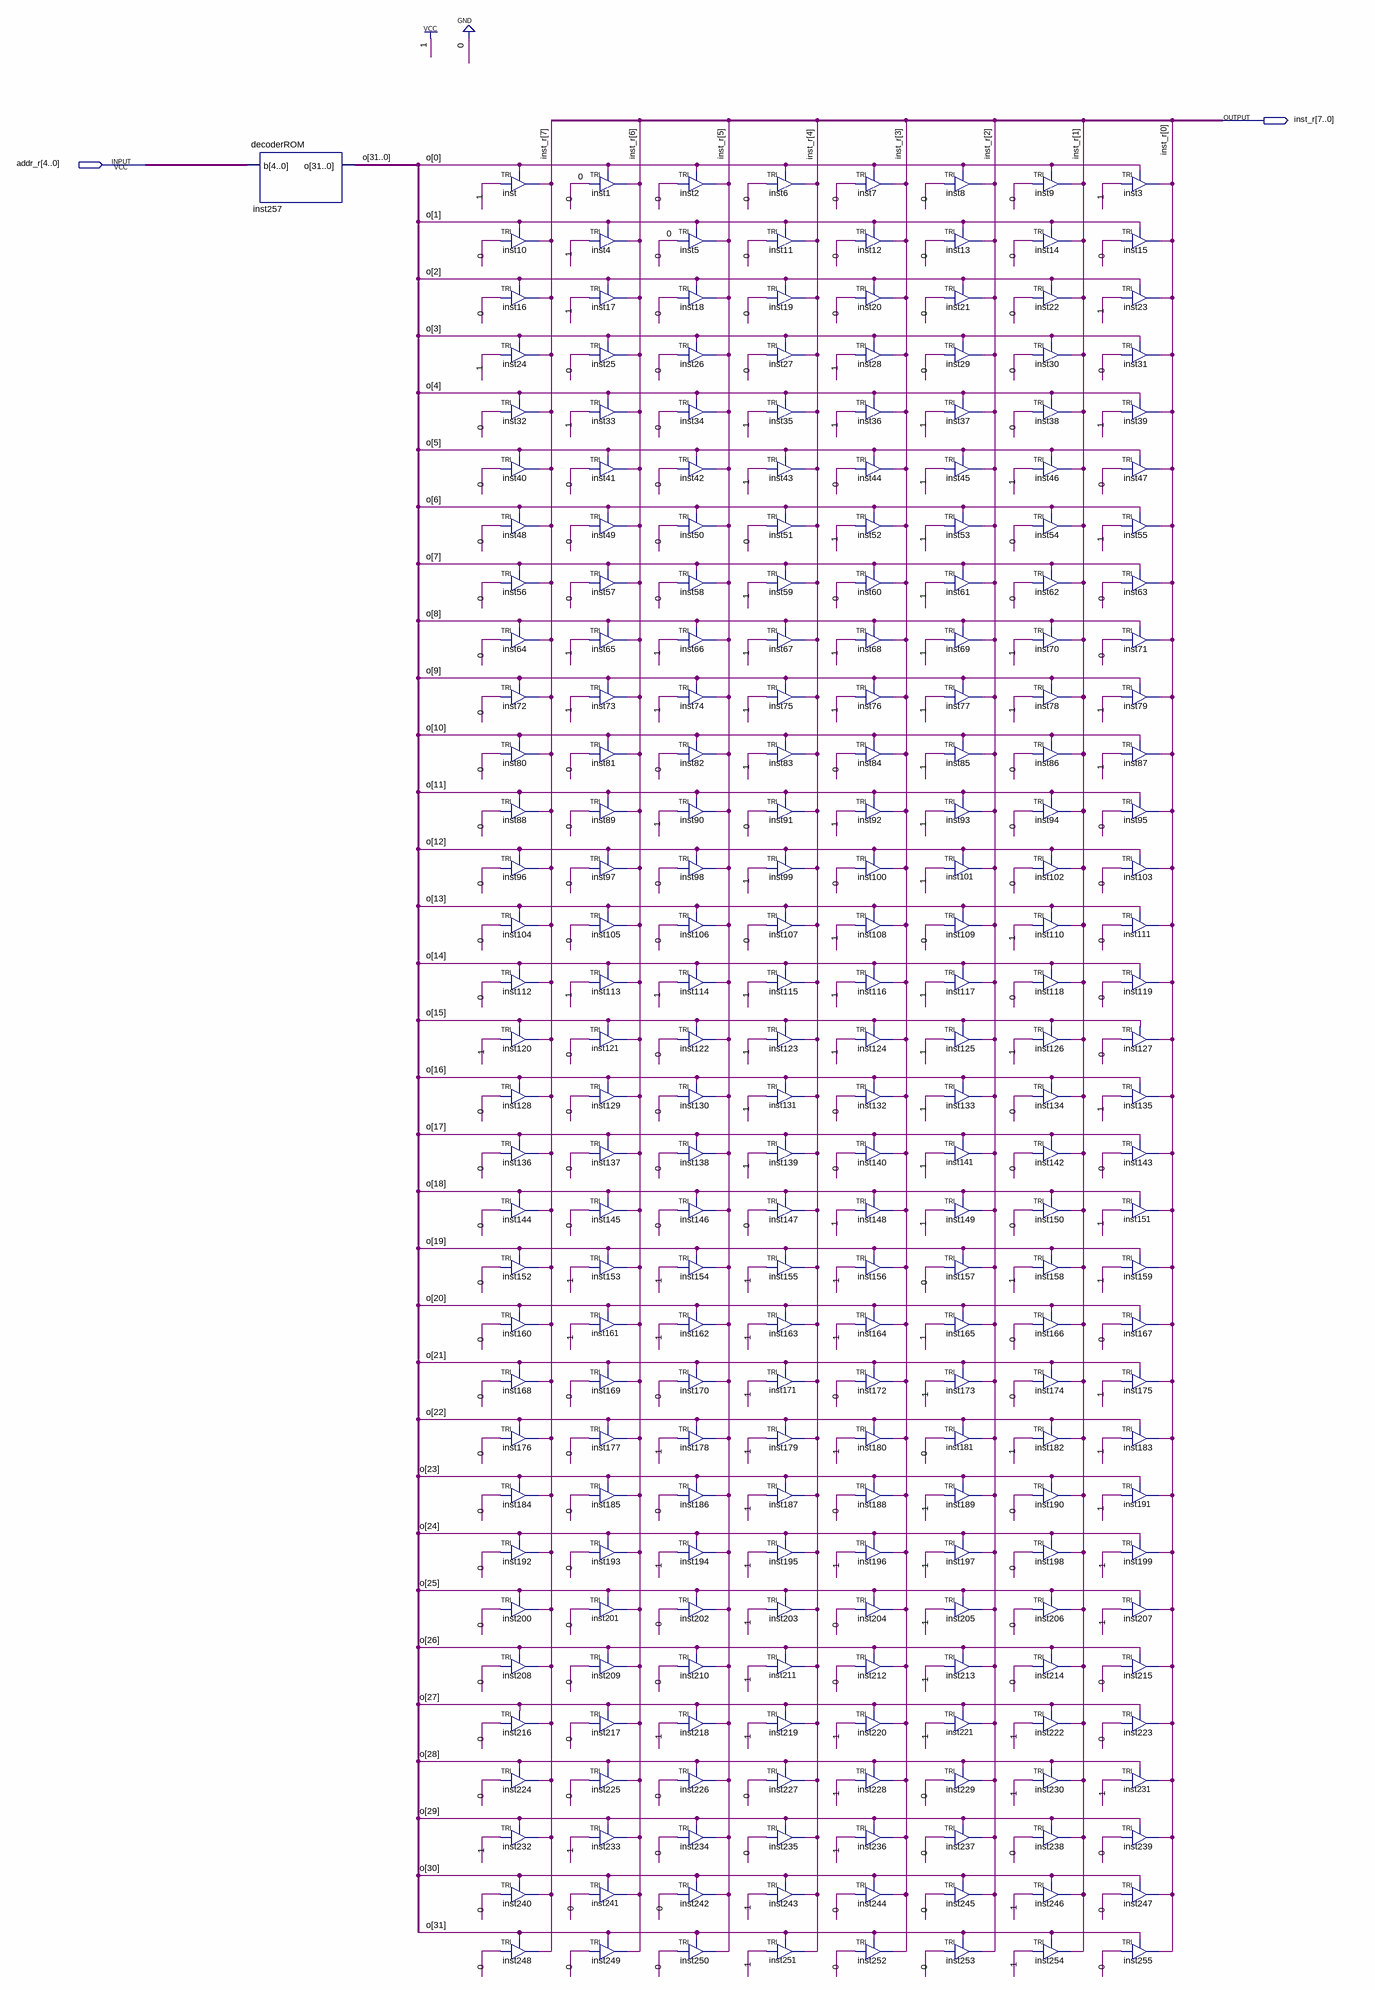
[diagram p0: schematic sheet]
// Quartus schematic programaFibonacci.bdf as structural Verilog: 257 symbols, 2 pins
module programaFibonacci (
  input  [4:0] addr_r,
  output [7:0] inst_r
);

  wire [31:0] o;

  decoderROM inst257 (.b(addr_r), .o(o));
  TRI inst (.IN(1'b1), .OE(o[0]), .OUT(inst_r[7]));
  TRI inst10 (.IN(1'b0), .OE(o[1]), .OUT(inst_r[7]));
  TRI inst16 (.IN(1'b0), .OE(o[2]), .OUT(inst_r[7]));
  TRI inst24 (.IN(1'b1), .OE(o[3]), .OUT(inst_r[7]));
  TRI inst32 (.IN(1'b0), .OE(o[4]), .OUT(inst_r[7]));
  TRI inst40 (.IN(1'b0), .OE(o[5]), .OUT(inst_r[7]));
  TRI inst48 (.IN(1'b0), .OE(o[6]), .OUT(inst_r[7]));
  TRI inst56 (.IN(1'b0), .OE(o[7]), .OUT(inst_r[7]));
  TRI inst64 (.IN(1'b0), .OE(o[8]), .OUT(inst_r[7]));
  TRI inst72 (.IN(1'b0), .OE(o[9]), .OUT(inst_r[7]));
  TRI inst80 (.IN(1'b0), .OE(o[10]), .OUT(inst_r[7]));
  TRI inst88 (.IN(1'b0), .OE(o[11]), .OUT(inst_r[7]));
  TRI inst96 (.IN(1'b0), .OE(o[12]), .OUT(inst_r[7]));
  TRI inst104 (.IN(1'b0), .OE(o[13]), .OUT(inst_r[7]));
  TRI inst112 (.IN(1'b0), .OE(o[14]), .OUT(inst_r[7]));
  TRI inst120 (.IN(1'b1), .OE(o[15]), .OUT(inst_r[7]));
  TRI inst128 (.IN(1'b0), .OE(o[16]), .OUT(inst_r[7]));
  TRI inst136 (.IN(1'b0), .OE(o[17]), .OUT(inst_r[7]));
  TRI inst144 (.IN(1'b0), .OE(o[18]), .OUT(inst_r[7]));
  TRI inst152 (.IN(1'b0), .OE(o[19]), .OUT(inst_r[7]));
  TRI inst160 (.IN(1'b0), .OE(o[20]), .OUT(inst_r[7]));
  TRI inst168 (.IN(1'b0), .OE(o[21]), .OUT(inst_r[7]));
  TRI inst176 (.IN(1'b0), .OE(o[22]), .OUT(inst_r[7]));
  TRI inst184 (.IN(1'b0), .OE(o[23]), .OUT(inst_r[7]));
  TRI inst192 (.IN(1'b0), .OE(o[24]), .OUT(inst_r[7]));
  TRI inst200 (.IN(1'b0), .OE(o[25]), .OUT(inst_r[7]));
  TRI inst208 (.IN(1'b0), .OE(o[26]), .OUT(inst_r[7]));
  TRI inst216 (.IN(1'b0), .OE(o[27]), .OUT(inst_r[7]));
  TRI inst224 (.IN(1'b0), .OE(o[28]), .OUT(inst_r[7]));
  TRI inst232 (.IN(1'b1), .OE(o[29]), .OUT(inst_r[7]));
  TRI inst240 (.IN(1'b0), .OE(o[30]), .OUT(inst_r[7]));
  TRI inst248 (.IN(1'b0), .OE(o[31]), .OUT(inst_r[7]));
  TRI inst1 (.IN(1'b0), .OE(o[0]), .OUT(inst_r[6]));
  TRI inst4 (.IN(1'b1), .OE(o[1]), .OUT(inst_r[6]));
  TRI inst17 (.IN(1'b1), .OE(o[2]), .OUT(inst_r[6]));
  TRI inst25 (.IN(1'b0), .OE(o[3]), .OUT(inst_r[6]));
  TRI inst33 (.IN(1'b1), .OE(o[4]), .OUT(inst_r[6]));
  TRI inst41 (.IN(1'b0), .OE(o[5]), .OUT(inst_r[6]));
  TRI inst49 (.IN(1'b0), .OE(o[6]), .OUT(inst_r[6]));
  TRI inst57 (.IN(1'b0), .OE(o[7]), .OUT(inst_r[6]));
  TRI inst65 (.IN(1'b1), .OE(o[8]), .OUT(inst_r[6]));
  TRI inst73 (.IN(1'b1), .OE(o[9]), .OUT(inst_r[6]));
  TRI inst81 (.IN(1'b0), .OE(o[10]), .OUT(inst_r[6]));
  TRI inst89 (.IN(1'b0), .OE(o[11]), .OUT(inst_r[6]));
  TRI inst97 (.IN(1'b0), .OE(o[12]), .OUT(inst_r[6]));
  TRI inst105 (.IN(1'b0), .OE(o[13]), .OUT(inst_r[6]));
  TRI inst113 (.IN(1'b1), .OE(o[14]), .OUT(inst_r[6]));
  TRI inst121 (.IN(1'b0), .OE(o[15]), .OUT(inst_r[6]));
  TRI inst129 (.IN(1'b0), .OE(o[16]), .OUT(inst_r[6]));
  TRI inst137 (.IN(1'b0), .OE(o[17]), .OUT(inst_r[6]));
  TRI inst145 (.IN(1'b0), .OE(o[18]), .OUT(inst_r[6]));
  TRI inst153 (.IN(1'b1), .OE(o[19]), .OUT(inst_r[6]));
  TRI inst161 (.IN(1'b1), .OE(o[20]), .OUT(inst_r[6]));
  TRI inst169 (.IN(1'b0), .OE(o[21]), .OUT(inst_r[6]));
  TRI inst177 (.IN(1'b0), .OE(o[22]), .OUT(inst_r[6]));
  TRI inst185 (.IN(1'b0), .OE(o[23]), .OUT(inst_r[6]));
  TRI inst193 (.IN(1'b0), .OE(o[24]), .OUT(inst_r[6]));
  TRI inst201 (.IN(1'b0), .OE(o[25]), .OUT(inst_r[6]));
  TRI inst209 (.IN(1'b0), .OE(o[26]), .OUT(inst_r[6]));
  TRI inst217 (.IN(1'b0), .OE(o[27]), .OUT(inst_r[6]));
  TRI inst225 (.IN(1'b0), .OE(o[28]), .OUT(inst_r[6]));
  TRI inst233 (.IN(1'b1), .OE(o[29]), .OUT(inst_r[6]));
  TRI inst241 (.IN(1'b0), .OE(o[30]), .OUT(inst_r[6]));
  TRI inst249 (.IN(1'b0), .OE(o[31]), .OUT(inst_r[6]));
  TRI inst2 (.IN(1'b0), .OE(o[0]), .OUT(inst_r[5]));
  TRI inst5 (.IN(1'b0), .OE(o[1]), .OUT(inst_r[5]));
  TRI inst18 (.IN(1'b0), .OE(o[2]), .OUT(inst_r[5]));
  TRI inst26 (.IN(1'b0), .OE(o[3]), .OUT(inst_r[5]));
  TRI inst34 (.IN(1'b0), .OE(o[4]), .OUT(inst_r[5]));
  TRI inst42 (.IN(1'b0), .OE(o[5]), .OUT(inst_r[5]));
  TRI inst50 (.IN(1'b0), .OE(o[6]), .OUT(inst_r[5]));
  TRI inst58 (.IN(1'b0), .OE(o[7]), .OUT(inst_r[5]));
  TRI inst66 (.IN(1'b1), .OE(o[8]), .OUT(inst_r[5]));
  TRI inst74 (.IN(1'b1), .OE(o[9]), .OUT(inst_r[5]));
  TRI inst82 (.IN(1'b0), .OE(o[10]), .OUT(inst_r[5]));
  TRI inst90 (.IN(1'b1), .OE(o[11]), .OUT(inst_r[5]));
  TRI inst98 (.IN(1'b0), .OE(o[12]), .OUT(inst_r[5]));
  TRI inst106 (.IN(1'b0), .OE(o[13]), .OUT(inst_r[5]));
  TRI inst114 (.IN(1'b1), .OE(o[14]), .OUT(inst_r[5]));
  TRI inst122 (.IN(1'b0), .OE(o[15]), .OUT(inst_r[5]));
  TRI inst130 (.IN(1'b0), .OE(o[16]), .OUT(inst_r[5]));
  TRI inst138 (.IN(1'b0), .OE(o[17]), .OUT(inst_r[5]));
  TRI inst146 (.IN(1'b0), .OE(o[18]), .OUT(inst_r[5]));
  TRI inst154 (.IN(1'b1), .OE(o[19]), .OUT(inst_r[5]));
  TRI inst162 (.IN(1'b1), .OE(o[20]), .OUT(inst_r[5]));
  TRI inst170 (.IN(1'b0), .OE(o[21]), .OUT(inst_r[5]));
  TRI inst178 (.IN(1'b1), .OE(o[22]), .OUT(inst_r[5]));
  TRI inst186 (.IN(1'b0), .OE(o[23]), .OUT(inst_r[5]));
  TRI inst194 (.IN(1'b1), .OE(o[24]), .OUT(inst_r[5]));
  TRI inst202 (.IN(1'b0), .OE(o[25]), .OUT(inst_r[5]));
  TRI inst210 (.IN(1'b0), .OE(o[26]), .OUT(inst_r[5]));
  TRI inst218 (.IN(1'b1), .OE(o[27]), .OUT(inst_r[5]));
  TRI inst226 (.IN(1'b0), .OE(o[28]), .OUT(inst_r[5]));
  TRI inst234 (.IN(1'b0), .OE(o[29]), .OUT(inst_r[5]));
  TRI inst242 (.IN(1'b0), .OE(o[30]), .OUT(inst_r[5]));
  TRI inst250 (.IN(1'b0), .OE(o[31]), .OUT(inst_r[5]));
  TRI inst6 (.IN(1'b0), .OE(o[0]), .OUT(inst_r[4]));
  TRI inst11 (.IN(1'b0), .OE(o[1]), .OUT(inst_r[4]));
  TRI inst19 (.IN(1'b0), .OE(o[2]), .OUT(inst_r[4]));
  TRI inst27 (.IN(1'b0), .OE(o[3]), .OUT(inst_r[4]));
  TRI inst35 (.IN(1'b1), .OE(o[4]), .OUT(inst_r[4]));
  TRI inst43 (.IN(1'b1), .OE(o[5]), .OUT(inst_r[4]));
  TRI inst51 (.IN(1'b0), .OE(o[6]), .OUT(inst_r[4]));
  TRI inst59 (.IN(1'b1), .OE(o[7]), .OUT(inst_r[4]));
  TRI inst67 (.IN(1'b1), .OE(o[8]), .OUT(inst_r[4]));
  TRI inst75 (.IN(1'b1), .OE(o[9]), .OUT(inst_r[4]));
  TRI inst83 (.IN(1'b1), .OE(o[10]), .OUT(inst_r[4]));
  TRI inst91 (.IN(1'b0), .OE(o[11]), .OUT(inst_r[4]));
  TRI inst99 (.IN(1'b1), .OE(o[12]), .OUT(inst_r[4]));
  TRI inst107 (.IN(1'b0), .OE(o[13]), .OUT(inst_r[4]));
  TRI inst115 (.IN(1'b1), .OE(o[14]), .OUT(inst_r[4]));
  TRI inst123 (.IN(1'b1), .OE(o[15]), .OUT(inst_r[4]));
  TRI inst131 (.IN(1'b1), .OE(o[16]), .OUT(inst_r[4]));
  TRI inst139 (.IN(1'b1), .OE(o[17]), .OUT(inst_r[4]));
  TRI inst147 (.IN(1'b0), .OE(o[18]), .OUT(inst_r[4]));
  TRI inst155 (.IN(1'b1), .OE(o[19]), .OUT(inst_r[4]));
  TRI inst163 (.IN(1'b1), .OE(o[20]), .OUT(inst_r[4]));
  TRI inst171 (.IN(1'b1), .OE(o[21]), .OUT(inst_r[4]));
  TRI inst179 (.IN(1'b1), .OE(o[22]), .OUT(inst_r[4]));
  TRI inst187 (.IN(1'b1), .OE(o[23]), .OUT(inst_r[4]));
  TRI inst195 (.IN(1'b1), .OE(o[24]), .OUT(inst_r[4]));
  TRI inst203 (.IN(1'b1), .OE(o[25]), .OUT(inst_r[4]));
  TRI inst211 (.IN(1'b1), .OE(o[26]), .OUT(inst_r[4]));
  TRI inst219 (.IN(1'b1), .OE(o[27]), .OUT(inst_r[4]));
  TRI inst227 (.IN(1'b0), .OE(o[28]), .OUT(inst_r[4]));
  TRI inst235 (.IN(1'b0), .OE(o[29]), .OUT(inst_r[4]));
  TRI inst243 (.IN(1'b1), .OE(o[30]), .OUT(inst_r[4]));
  TRI inst251 (.IN(1'b1), .OE(o[31]), .OUT(inst_r[4]));
  TRI inst7 (.IN(1'b0), .OE(o[0]), .OUT(inst_r[3]));
  TRI inst12 (.IN(1'b0), .OE(o[1]), .OUT(inst_r[3]));
  TRI inst20 (.IN(1'b0), .OE(o[2]), .OUT(inst_r[3]));
  TRI inst28 (.IN(1'b1), .OE(o[3]), .OUT(inst_r[3]));
  TRI inst36 (.IN(1'b1), .OE(o[4]), .OUT(inst_r[3]));
  TRI inst44 (.IN(1'b0), .OE(o[5]), .OUT(inst_r[3]));
  TRI inst52 (.IN(1'b1), .OE(o[6]), .OUT(inst_r[3]));
  TRI inst60 (.IN(1'b0), .OE(o[7]), .OUT(inst_r[3]));
  TRI inst68 (.IN(1'b1), .OE(o[8]), .OUT(inst_r[3]));
  TRI inst76 (.IN(1'b1), .OE(o[9]), .OUT(inst_r[3]));
  TRI inst84 (.IN(1'b0), .OE(o[10]), .OUT(inst_r[3]));
  TRI inst92 (.IN(1'b1), .OE(o[11]), .OUT(inst_r[3]));
  TRI inst100 (.IN(1'b0), .OE(o[12]), .OUT(inst_r[3]));
  TRI inst108 (.IN(1'b1), .OE(o[13]), .OUT(inst_r[3]));
  TRI inst116 (.IN(1'b1), .OE(o[14]), .OUT(inst_r[3]));
  TRI inst124 (.IN(1'b1), .OE(o[15]), .OUT(inst_r[3]));
  TRI inst132 (.IN(1'b0), .OE(o[16]), .OUT(inst_r[3]));
  TRI inst140 (.IN(1'b0), .OE(o[17]), .OUT(inst_r[3]));
  TRI inst148 (.IN(1'b1), .OE(o[18]), .OUT(inst_r[3]));
  TRI inst156 (.IN(1'b1), .OE(o[19]), .OUT(inst_r[3]));
  TRI inst164 (.IN(1'b1), .OE(o[20]), .OUT(inst_r[3]));
  TRI inst172 (.IN(1'b0), .OE(o[21]), .OUT(inst_r[3]));
  TRI inst180 (.IN(1'b1), .OE(o[22]), .OUT(inst_r[3]));
  TRI inst188 (.IN(1'b0), .OE(o[23]), .OUT(inst_r[3]));
  TRI inst196 (.IN(1'b1), .OE(o[24]), .OUT(inst_r[3]));
  TRI inst204 (.IN(1'b0), .OE(o[25]), .OUT(inst_r[3]));
  TRI inst212 (.IN(1'b0), .OE(o[26]), .OUT(inst_r[3]));
  TRI inst220 (.IN(1'b1), .OE(o[27]), .OUT(inst_r[3]));
  TRI inst228 (.IN(1'b1), .OE(o[28]), .OUT(inst_r[3]));
  TRI inst236 (.IN(1'b1), .OE(o[29]), .OUT(inst_r[3]));
  TRI inst244 (.IN(1'b0), .OE(o[30]), .OUT(inst_r[3]));
  TRI inst252 (.IN(1'b0), .OE(o[31]), .OUT(inst_r[3]));
  TRI inst8 (.IN(1'b0), .OE(o[0]), .OUT(inst_r[2]));
  TRI inst13 (.IN(1'b0), .OE(o[1]), .OUT(inst_r[2]));
  TRI inst21 (.IN(1'b0), .OE(o[2]), .OUT(inst_r[2]));
  TRI inst29 (.IN(1'b0), .OE(o[3]), .OUT(inst_r[2]));
  TRI inst37 (.IN(1'b1), .OE(o[4]), .OUT(inst_r[2]));
  TRI inst45 (.IN(1'b1), .OE(o[5]), .OUT(inst_r[2]));
  TRI inst53 (.IN(1'b1), .OE(o[6]), .OUT(inst_r[2]));
  TRI inst61 (.IN(1'b1), .OE(o[7]), .OUT(inst_r[2]));
  TRI inst69 (.IN(1'b1), .OE(o[8]), .OUT(inst_r[2]));
  TRI inst77 (.IN(1'b1), .OE(o[9]), .OUT(inst_r[2]));
  TRI inst85 (.IN(1'b1), .OE(o[10]), .OUT(inst_r[2]));
  TRI inst93 (.IN(1'b1), .OE(o[11]), .OUT(inst_r[2]));
  TRI inst101 (.IN(1'b1), .OE(o[12]), .OUT(inst_r[2]));
  TRI inst109 (.IN(1'b0), .OE(o[13]), .OUT(inst_r[2]));
  TRI inst117 (.IN(1'b1), .OE(o[14]), .OUT(inst_r[2]));
  TRI inst125 (.IN(1'b1), .OE(o[15]), .OUT(inst_r[2]));
  TRI inst133 (.IN(1'b1), .OE(o[16]), .OUT(inst_r[2]));
  TRI inst141 (.IN(1'b1), .OE(o[17]), .OUT(inst_r[2]));
  TRI inst149 (.IN(1'b1), .OE(o[18]), .OUT(inst_r[2]));
  TRI inst157 (.IN(1'b0), .OE(o[19]), .OUT(inst_r[2]));
  TRI inst165 (.IN(1'b1), .OE(o[20]), .OUT(inst_r[2]));
  TRI inst173 (.IN(1'b1), .OE(o[21]), .OUT(inst_r[2]));
  TRI inst181 (.IN(1'b0), .OE(o[22]), .OUT(inst_r[2]));
  TRI inst189 (.IN(1'b1), .OE(o[23]), .OUT(inst_r[2]));
  TRI inst197 (.IN(1'b1), .OE(o[24]), .OUT(inst_r[2]));
  TRI inst205 (.IN(1'b1), .OE(o[25]), .OUT(inst_r[2]));
  TRI inst213 (.IN(1'b1), .OE(o[26]), .OUT(inst_r[2]));
  TRI inst221 (.IN(1'b1), .OE(o[27]), .OUT(inst_r[2]));
  TRI inst229 (.IN(1'b0), .OE(o[28]), .OUT(inst_r[2]));
  TRI inst237 (.IN(1'b0), .OE(o[29]), .OUT(inst_r[2]));
  TRI inst245 (.IN(1'b0), .OE(o[30]), .OUT(inst_r[2]));
  TRI inst253 (.IN(1'b0), .OE(o[31]), .OUT(inst_r[2]));
  TRI inst9 (.IN(1'b0), .OE(o[0]), .OUT(inst_r[1]));
  TRI inst14 (.IN(1'b0), .OE(o[1]), .OUT(inst_r[1]));
  TRI inst22 (.IN(1'b0), .OE(o[2]), .OUT(inst_r[1]));
  TRI inst30 (.IN(1'b0), .OE(o[3]), .OUT(inst_r[1]));
  TRI inst38 (.IN(1'b0), .OE(o[4]), .OUT(inst_r[1]));
  TRI inst46 (.IN(1'b1), .OE(o[5]), .OUT(inst_r[1]));
  TRI inst54 (.IN(1'b0), .OE(o[6]), .OUT(inst_r[1]));
  TRI inst62 (.IN(1'b0), .OE(o[7]), .OUT(inst_r[1]));
  TRI inst70 (.IN(1'b1), .OE(o[8]), .OUT(inst_r[1]));
  TRI inst78 (.IN(1'b1), .OE(o[9]), .OUT(inst_r[1]));
  TRI inst86 (.IN(1'b0), .OE(o[10]), .OUT(inst_r[1]));
  TRI inst94 (.IN(1'b0), .OE(o[11]), .OUT(inst_r[1]));
  TRI inst102 (.IN(1'b0), .OE(o[12]), .OUT(inst_r[1]));
  TRI inst110 (.IN(1'b1), .OE(o[13]), .OUT(inst_r[1]));
  TRI inst118 (.IN(1'b0), .OE(o[14]), .OUT(inst_r[1]));
  TRI inst126 (.IN(1'b1), .OE(o[15]), .OUT(inst_r[1]));
  TRI inst134 (.IN(1'b0), .OE(o[16]), .OUT(inst_r[1]));
  TRI inst142 (.IN(1'b0), .OE(o[17]), .OUT(inst_r[1]));
  TRI inst150 (.IN(1'b0), .OE(o[18]), .OUT(inst_r[1]));
  TRI inst158 (.IN(1'b1), .OE(o[19]), .OUT(inst_r[1]));
  TRI inst166 (.IN(1'b0), .OE(o[20]), .OUT(inst_r[1]));
  TRI inst174 (.IN(1'b0), .OE(o[21]), .OUT(inst_r[1]));
  TRI inst182 (.IN(1'b1), .OE(o[22]), .OUT(inst_r[1]));
  TRI inst190 (.IN(1'b0), .OE(o[23]), .OUT(inst_r[1]));
  TRI inst198 (.IN(1'b0), .OE(o[24]), .OUT(inst_r[1]));
  TRI inst206 (.IN(1'b0), .OE(o[25]), .OUT(inst_r[1]));
  TRI inst214 (.IN(1'b0), .OE(o[26]), .OUT(inst_r[1]));
  TRI inst222 (.IN(1'b1), .OE(o[27]), .OUT(inst_r[1]));
  TRI inst230 (.IN(1'b1), .OE(o[28]), .OUT(inst_r[1]));
  TRI inst238 (.IN(1'b0), .OE(o[29]), .OUT(inst_r[1]));
  TRI inst246 (.IN(1'b1), .OE(o[30]), .OUT(inst_r[1]));
  TRI inst254 (.IN(1'b1), .OE(o[31]), .OUT(inst_r[1]));
  TRI inst3 (.IN(1'b1), .OE(o[0]), .OUT(inst_r[0]));
  TRI inst15 (.IN(1'b0), .OE(o[1]), .OUT(inst_r[0]));
  TRI inst23 (.IN(1'b1), .OE(o[2]), .OUT(inst_r[0]));
  TRI inst31 (.IN(1'b0), .OE(o[3]), .OUT(inst_r[0]));
  TRI inst39 (.IN(1'b1), .OE(o[4]), .OUT(inst_r[0]));
  TRI inst47 (.IN(1'b0), .OE(o[5]), .OUT(inst_r[0]));
  TRI inst55 (.IN(1'b1), .OE(o[6]), .OUT(inst_r[0]));
  TRI inst63 (.IN(1'b0), .OE(o[7]), .OUT(inst_r[0]));
  TRI inst71 (.IN(1'b0), .OE(o[8]), .OUT(inst_r[0]));
  TRI inst79 (.IN(1'b1), .OE(o[9]), .OUT(inst_r[0]));
  TRI inst87 (.IN(1'b1), .OE(o[10]), .OUT(inst_r[0]));
  TRI inst95 (.IN(1'b0), .OE(o[11]), .OUT(inst_r[0]));
  TRI inst103 (.IN(1'b0), .OE(o[12]), .OUT(inst_r[0]));
  TRI inst111 (.IN(1'b0), .OE(o[13]), .OUT(inst_r[0]));
  TRI inst119 (.IN(1'b0), .OE(o[14]), .OUT(inst_r[0]));
  TRI inst127 (.IN(1'b0), .OE(o[15]), .OUT(inst_r[0]));
  TRI inst135 (.IN(1'b1), .OE(o[16]), .OUT(inst_r[0]));
  TRI inst143 (.IN(1'b0), .OE(o[17]), .OUT(inst_r[0]));
  TRI inst151 (.IN(1'b1), .OE(o[18]), .OUT(inst_r[0]));
  TRI inst159 (.IN(1'b1), .OE(o[19]), .OUT(inst_r[0]));
  TRI inst167 (.IN(1'b0), .OE(o[20]), .OUT(inst_r[0]));
  TRI inst175 (.IN(1'b1), .OE(o[21]), .OUT(inst_r[0]));
  TRI inst183 (.IN(1'b1), .OE(o[22]), .OUT(inst_r[0]));
  TRI inst191 (.IN(1'b1), .OE(o[23]), .OUT(inst_r[0]));
  TRI inst199 (.IN(1'b1), .OE(o[24]), .OUT(inst_r[0]));
  TRI inst207 (.IN(1'b1), .OE(o[25]), .OUT(inst_r[0]));
  TRI inst215 (.IN(1'b0), .OE(o[26]), .OUT(inst_r[0]));
  TRI inst223 (.IN(1'b0), .OE(o[27]), .OUT(inst_r[0]));
  TRI inst231 (.IN(1'b1), .OE(o[28]), .OUT(inst_r[0]));
  TRI inst239 (.IN(1'b0), .OE(o[29]), .OUT(inst_r[0]));
  TRI inst247 (.IN(1'b0), .OE(o[30]), .OUT(inst_r[0]));
  TRI inst255 (.IN(1'b0), .OE(o[31]), .OUT(inst_r[0]));
endmodule
